# EAGLE schematic doodle with onboard clock smd 7805 l293dd 3 (EAGLE 6.2)
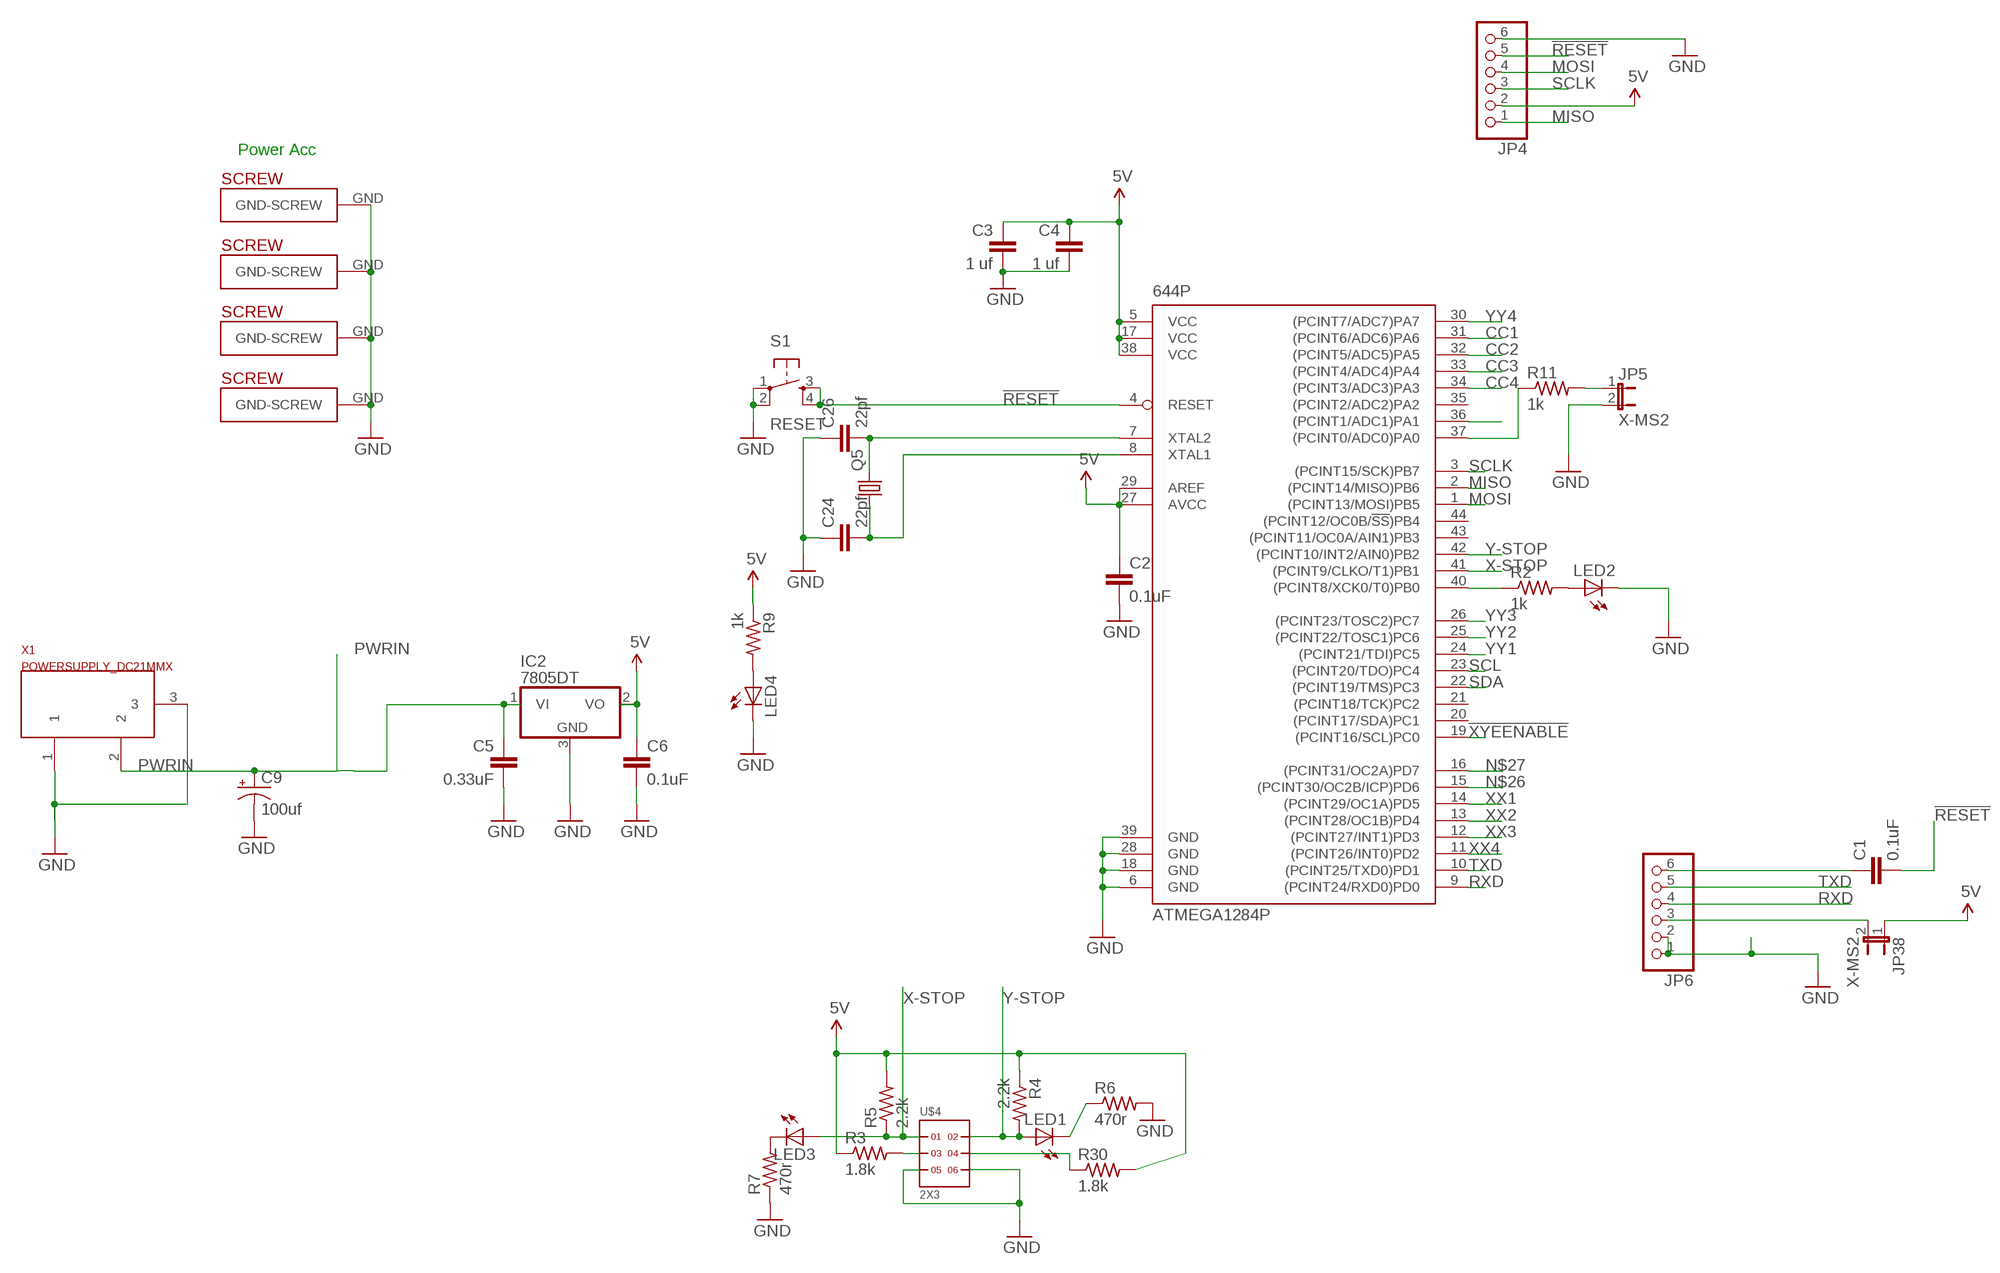
[diagram p0: schematic, sheet 1, part 1 of 2]
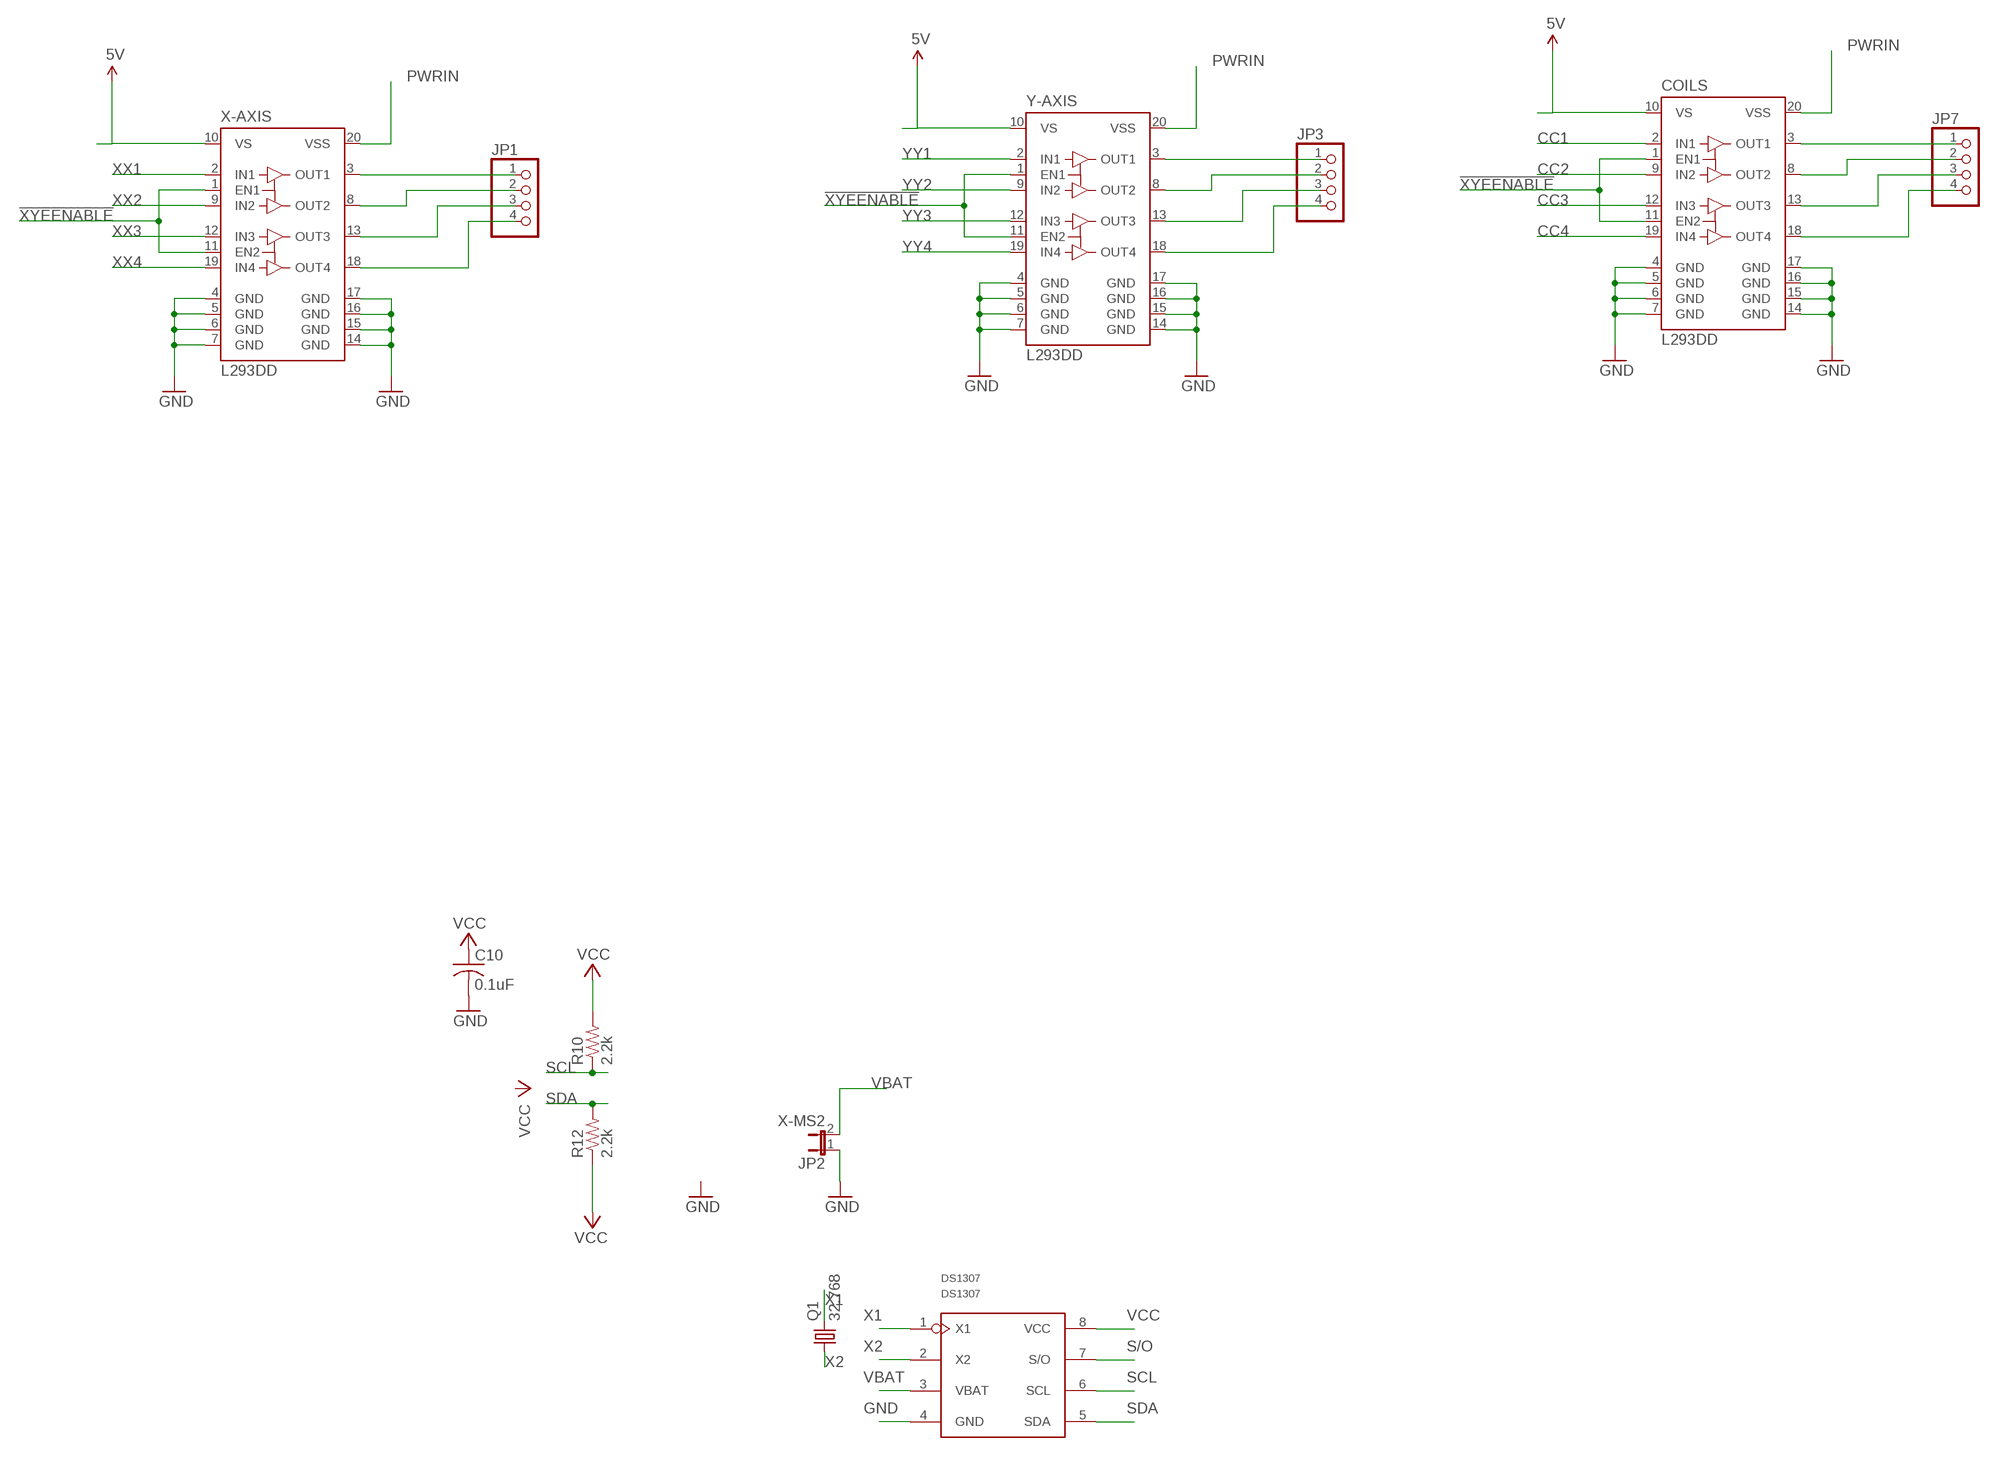
[diagram p1: schematic, sheet 1, part 2 of 2]

## Parts
644P  ATMEGA1284P  ATMEGA644A  [TQFP44]
C1  0.1uF  CAP0805  [0805]
C2  0.1uF  CAP0805  [0805]
C3  1 uf  CAP0805  [0805]
C4  1 uf  CAP0805  [0805]
C5  0.33uF  CAPPTH2  [CAP-PTH-SMALL2]
C6  0.1uF  CAPPTH2  [CAP-PTH-SMALL2]
C9  100uf  CAP_POLPTH1  [CPOL-RADIAL-100UF-25V]
C10  0.1uF  C-USC0805  [C0805]
C24  22pf  CAP0805  [0805]
C26  22pf  CAP0805  [0805]
COILS  L293DD  [SO20]
DS1307  DS1307  [SO08]
IC2  7805DT  [TO252]
JP1  PINHD-1X4  [1X04]
JP2  X-MS2  JUMPER-2PTH  [1X02]
JP3  PINHD-1X4  [1X04]
JP4  PINHD-1X6/90  [1X06/90]
JP5  X-MS2  JUMPER-2PTH  [1X02]
JP6  PINHD-1X6  [1X06]
JP7  PINHD-1X4  [1X04]
JP38  X-MS2  JUMPER-2PTH  [1X02]
LED1  LEDCHIPLED_0805  [CHIPLED_0805]
LED2  LEDCHIPLED_0805  [CHIPLED_0805]
LED3  LEDCHIPLED_0805  [CHIPLED_0805]
LED4  LEDCHIPLED_0805  [CHIPLED_0805]
Q1  32.768  CRYTALTC38H  [TC38H]
Q5  CRYSTALHC49S  [HC49/S]
R2  1k  R-US_R0805  [R0805]
R3  1.8k  R-US_R0805  [R0805]
R4  2.2k  R-US_R0805  [R0805]
R5  2.2k  R-US_R0805  [R0805]
R6  470r  R-US_R0805  [R0805]
R7  470r  R-US_R0805  [R0805]
R9  1k  R-US_R0805  [R0805]
R10  2.2k  R-US_R0805  [R0805]
R11  1k  R-US_R0805  [R0805]
R12  2.2k  R-US_R0805  [R0805]
R30  1.8k  R-US_R0603  [R0603]
S1  RESET  TAC_SWITCHPTH  [TACTILE-PTH]
U$4  2X3  [2X3]
U$14  PLATED-SCREW  [PLATEDSCREW]
U$17  PLATED-SCREW  [PLATEDSCREW]
U$18  PLATED-SCREW  [PLATEDSCREW]
U$38  PLATED-SCREW  [PLATEDSCREW]
X1  POWERSUPPLY_DC21MMX  [POWERSUPPLY_DC-21MM]
X-AXIS  L293DD  [SO20]
Y-AXIS  L293DD  [SO20]

## Nets
5V: 644P.5(VCC) 644P.17(VCC) 644P.27(AVCC) 644P.29(AREF) 644P.38(VCC) C2.1 C3.1 C4.1 C6.1 COILS.10(VS) IC2.2(VO) JP4.2 JP38.1 R3.1 R4.1 R5.2 R9.1 R30.2 X-AXIS.10(VS) Y-AXIS.10(VS)
!RESET: 644P.4(RESET) C1.2 JP4.5 S1.3 S1.4
!XYEENABLE: 644P.19((PCINT16/SCL)PC0) COILS.1(EN1) COILS.11(EN2) X-AXIS.1(EN1) X-AXIS.11(EN2) Y-AXIS.1(EN1) Y-AXIS.11(EN2)
CC1: 644P.31((PCINT6/ADC6)PA6) COILS.2(IN1)
CC2: 644P.32((PCINT5/ADC5)PA5) COILS.9(IN2)
CC3: 644P.33((PCINT4/ADC4)PA4) COILS.12(IN3)
CC4: 644P.34((PCINT3/ADC3)PA3) COILS.19(IN4)
GND: 644P.6(GND) 644P.18(GND) 644P.28(GND) 644P.39(GND) C2.2 C3.2 C4.2 C5.2 C6.2 C9.2(-) C10.2 C24.1 C26.1 COILS.4(GND) COILS.5(GND) COILS.6(GND) COILS.7(GND) COILS.14(GND) COILS.15(GND) COILS.16(GND) COILS.17(GND) DS1307.4(GND) IC2.3(GND) JP2.1 JP4.6 JP5.2 JP6.1 JP6.2 LED2.C LED4.C R6.2 R7.1 S1.1 S1.2 U$4.5 U$4.6 U$14.GND(GND-SCREW) U$17.GND(GND-SCREW) U$18.GND(GND-SCREW) U$38.GND(GND-SCREW) X1.1 X1.3 X-AXIS.4(GND) X-AXIS.5(GND) X-AXIS.6(GND) X-AXIS.7(GND) X-AXIS.14(GND) X-AXIS.15(GND) X-AXIS.16(GND) X-AXIS.17(GND) Y-AXIS.4(GND) Y-AXIS.5(GND) Y-AXIS.6(GND) Y-AXIS.7(GND) Y-AXIS.14(GND) Y-AXIS.15(GND) Y-AXIS.16(GND) Y-AXIS.17(GND)
MISO: 644P.2((PCINT14/MISO)PB6) JP4.1
MOSI: 644P.1((PCINT13/MOSI)PB5) JP4.4
N$1: JP1.1 X-AXIS.3(OUT1)
N$2: JP1.2 X-AXIS.8(OUT2)
N$3: JP1.3 X-AXIS.13(OUT3)
N$4: JP1.4 X-AXIS.18(OUT4)
N$5: JP3.1 Y-AXIS.3(OUT1)
N$6: R3.2 U$4.3
N$9: LED2.A R2.2
N$10: 644P.40((PCINT8/XCK0/T0)PB0) R2.1
N$11: LED1.C R6.1
N$12: LED3.C R7.2
N$13: R30.1 U$4.4
N$14: JP3.2 Y-AXIS.8(OUT2)
N$15: JP3.3 Y-AXIS.13(OUT3)
N$16: JP3.4 Y-AXIS.18(OUT4)
N$17: COILS.3(OUT1) JP7.1
N$18: 644P.36((PCINT1/ADC1)PA1)
N$19: LED4.A R9.2
N$20: JP5.1 R11.2
N$21: COILS.8(OUT2) JP7.2
N$22: COILS.13(OUT3) JP7.3
N$23: COILS.18(OUT4) JP7.4
N$24: 644P.37((PCINT0/ADC0)PA0) R11.1
N$26: 644P.15((PCINT30/OC2B/ICP)PD6)
N$27: 644P.16((PCINT31/OC2A)PD7)
N$70: C1.1 JP6.6
N$71: JP6.3 JP38.2
N$80: 644P.7(XTAL2) C26.2 Q5.2
N$81: 644P.8(XTAL1) C24.2 Q5.1
PWRIN [power]: C5.1 C9.1(+) COILS.20(VSS) IC2.1(VI) X1.2 X-AXIS.20(VSS) Y-AXIS.20(VSS)
RXD: 644P.9((PCINT24/RXD0)PD0) JP6.4
S/O: DS1307.7(S/O)
SCL: 644P.23((PCINT20/TDO)PC4) DS1307.6(SCL) R10.1
SCLK: 644P.3((PCINT15/SCK)PB7) JP4.3
SDA: 644P.22((PCINT19/TMS)PC3) DS1307.5(SDA) R12.2
TXD: 644P.10((PCINT25/TXD0)PD1) JP6.5
VBAT: DS1307.3(VBAT) JP2.2
VCC: C10.1 DS1307.8(VCC) R10.2 R12.1
X1: DS1307.1(X1) Q1.2
X2: DS1307.2(X2) Q1.1
X-STOP: 644P.41((PCINT9/CLKO/T1)PB1) LED3.A R5.1 U$4.1
XX1: 644P.14((PCINT29/OC1A)PD5) X-AXIS.2(IN1)
XX2: 644P.13((PCINT28/OC1B)PD4) X-AXIS.9(IN2)
XX3: 644P.12((PCINT27/INT1)PD3) X-AXIS.12(IN3)
XX4: 644P.11((PCINT26/INT0)PD2) X-AXIS.19(IN4)
Y-STOP: 644P.42((PCINT10/INT2/AIN0)PB2) LED1.A R4.2 U$4.2
YY1: 644P.24((PCINT21/TDI)PC5) Y-AXIS.2(IN1)
YY2: 644P.25((PCINT22/TOSC1)PC6) Y-AXIS.9(IN2)
YY3: 644P.26((PCINT23/TOSC2)PC7) Y-AXIS.12(IN3)
YY4: 644P.30((PCINT7/ADC7)PA7) Y-AXIS.19(IN4)
Unconnected: 644P.20((PCINT17/SDA)PC1) 644P.21((PCINT18/TCK)PC2) 644P.35((PCINT2/ADC2)PA2) 644P.43((PCINT11/OC0A/AIN1)PB3) 644P.44((PCINT12/OC0B/!SS!)PB4)

## Notes on the sheet
- Power Acc

## Library data of the parts
644P = atmel:ATMEGA644: 8-bit Microcontroller with 64K Bytes In-System Programmable Flash Source: http://www.atmel.com/dyn/resources/prod_documents/doc2593.pdf; MPN: ATMEGA644PV-10AU; OC_FARNELL: 1455123; OC_NEWARK: 58M3748
C1-C6 C24 C26 = SparkFun:CAP: Capacitor Standard 0603 ceramic capacitor, and 0.1" leaded capacitor.
C9 = SparkFun:CAP_POL: Capacitor Polarized These are standard SMD and PTH capacitors. Normally 10uF, 47uF, and 100uF in electrolytic and tantalum varieties. Always verify the external diameter of the through hole cap, it varies with capacity, voltage, and manufacturer. The EIA devices should be standard.
C10 = adafruit:C-US: CAPACITOR, American symbol
COILS X-AXIS Y-AXIS = st-microelectronics:L293DD: PUSH-PULL FOUR CHANNEL DRIVER WITH DIODES Source: http://www.st.com/stonline/books/pdf/docs/1330.pdf; OC_FARNELL: unknown
DS1307 = Seeed:DS1307
IC2 = linear:78*: Positive VOLTAGE REGULATOR Source: http://cache.national.com/ds/LM/LM78L05.pdf http://www.fairchildsemi.com/ds/LM/LM7805.pdf
JP1 JP3 JP7 = pinhead:PINHD-1X4: PIN HEADER
JP2 JP5 JP38 = SparkFun:JUMPER-2: Jumper Basic 0.1" spaced jumper. Use with breakaway headers.
JP4 JP6 = pinhead:PINHD-1X6: PIN HEADER
LED1-LED4 = led:LED: LED OSRAM: - CHIPLED LG R971, LG N971, LY N971, LG Q971, LY Q971, LO R971, LY R971 LH N974, LH R974 LS Q976, LO Q976, LY Q976 LO Q996 - Hyper CHIPLED LW Q18S LB Q993, LB Q99A, LB R99A - SideLED LS A670, LO A670, LY A670, LG A670, LP A670 LB A673, LV A673, LT A673, LW A673 LH A674 LY A675 LS A676, LA A676, LO A676, LY A676, LW A676 LS A679, LY A679, LG A679 - Hyper Micro SIDELED® LS Y876, LA Y876, LO Y876, LY Y876 LT Y87S - SmartLED LW L88C, LW L88S LB L89C, LB L89S, LG L890 LS L89K, LO L89K, LY L89K LS L896, LA L896, LO L896, LY L896 - TOPLED LS T670, LO T670, LY T670, LG T670, LP T670 LSG T670, LSP T670, LSY T670, LOP T670, LYG T670 LG T671, LOG T671, LSG T671 LB T673, LV T673, LT T673, LW T673 LH T674 LS T676, LA T676, LO T676, LY T676, LB T676, LH T676, LSB T676, LW T676 LB T67C, LV T67C, LT T67C, LS T67K, LO T67K, LY T67K, LW E67C LS E67B, LA E67B, LO E67B, LY E67B, LB E67C, LV E67C, LT E67C LW T67C LS T679, LY T679, LG T679 LS T770, LO T770, LY T770, LG T770, LP T770 LB T773, LV T773, LT T773, LW T773 LH T774 LS E675, LA E675, LY E675, LS T675 LS T776, LA T776, LO T776, LY T776, LB T776 LHGB T686 LT T68C, LB T68C - Hyper Mini TOPLED® LB M676 - Mini TOPLED Santana® LG M470 LS M47K, LO M47K, LY M47K Source: http://www.osram.convergy.de LUXEON: - LUMILED® LXK2-PW12-R00, LXK2-PW12-S00, LXK2-PW14-U00, LXK2-PW14-V00 LXK2-PM12-R00, LXK2-PM12-S00, LXK2-PM14-U00 LXK2-PE12-Q00, LXK2-PE12-R00, LXK2-PE12-S00, LXK2-PE14-T00, LXK2-PE14-U00 LXK2-PB12-K00, LXK2-PB12-L00, LXK2-PB12-M00, LXK2-PB14-N00, LXK2-PB14-P00, LXK2-PB14-Q00 LXK2-PR12-L00, LXK2-PR12-M00, LXK2-PR14-Q00, LXK2-PR14-R00 LXK2-PD12-Q00, LXK2-PD12-R00, LXK2-PD12-S00 LXK2-PH12-R00, LXK2-PH12-S00 LXK2-PL12-P00, LXK2-PL12-Q00, LXK2-PL12-R00 Source: www.luxeon.com KINGBRIGHT: KA-3528ASYC Source: www.kingbright.com
Q1 = crystal:CRYTAL: CRYSTAL
Q5 = crystal:CRYSTAL: CRYSTAL; OC_FARNELL: 1667008; OC_NEWARK: unknown
R2-R7 R9-R12 R30 = resistor:R-US_: RESISTOR, American symbol
S1 = SparkFun:TAC_SWITCH: Momentary Switch Button commonly used for reset or general input. Spark Fun Electronics SKU : COM-00097
U$4 = headers(2mm):2X3
U$14 U$17 U$18 U$38 = Sanguinololu:PLATED-SCREW
X1 = SmartPrj:POWERSUPPLY_DC21MM